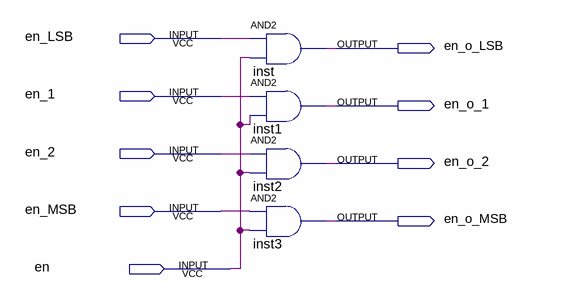
[diagram p0: schematic sheet]
// Quartus schematic enable.bdf as structural Verilog: 4 symbols, 9 pins
module enable (
  input  en_LSB,
  input  en_1,
  input  en_2,
  input  en_MSB,
  input  en,
  output en_o_LSB,
  output en_o_1,
  output en_o_2,
  output en_o_MSB
);

  and inst (en_o_LSB, en_LSB, en);
  and inst1 (en_o_1, en_1, en);
  and inst2 (en_o_2, en_2, en);
  and inst3 (en_o_MSB, en_MSB, en);
endmodule
